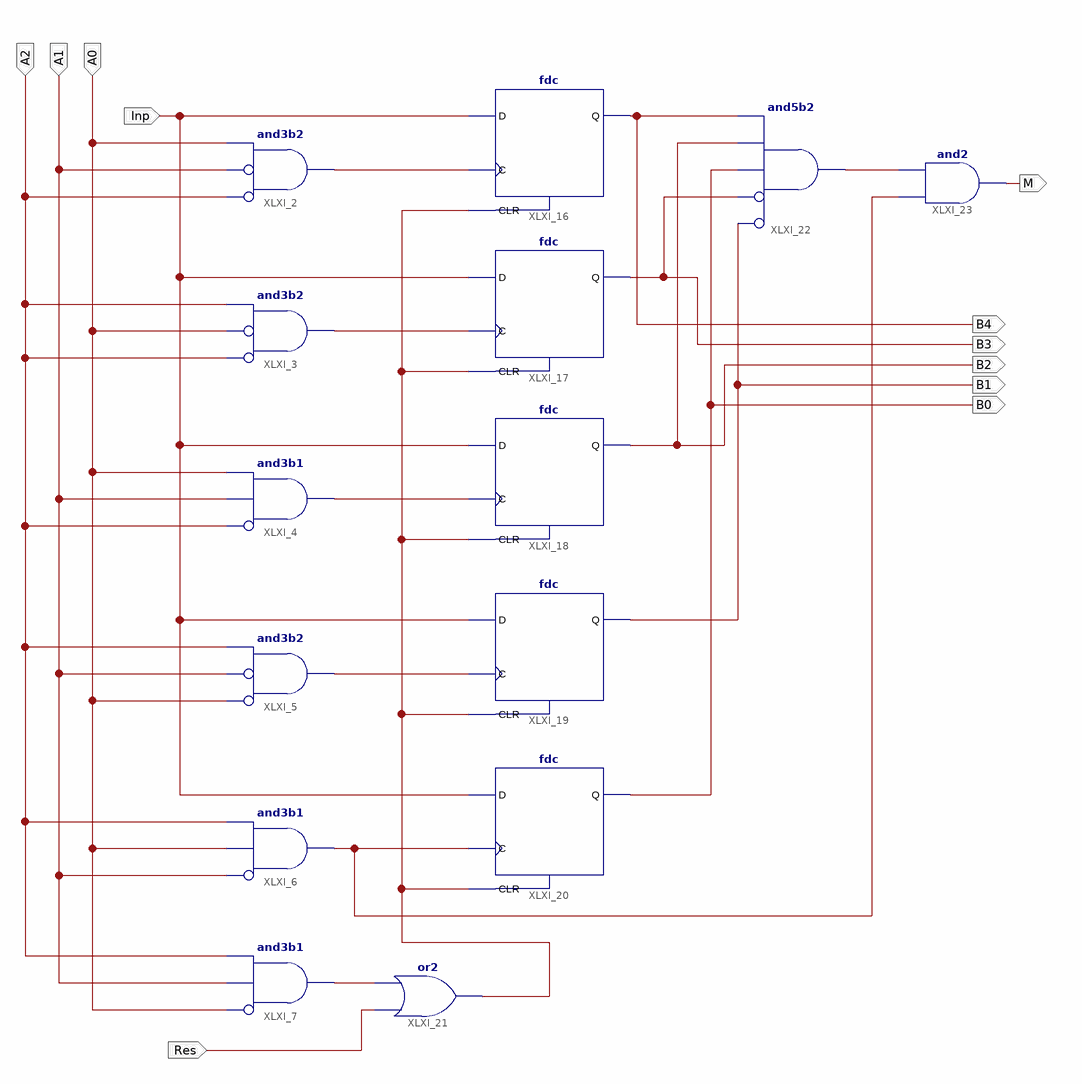
[diagram p0: schematic sheet 1]
// Xilinx ISE schematic registerMatch.sch (xc9500xl) as structural Verilog: 14 symbols, 11 ports
module registerMatch (
  input  A0,
  input  A1,
  input  A2,
  input  Inp,
  input  Res,
  output B4,
  output B0,
  output B1,
  output M,
  output B3,
  output B2
);

  wire XLXN_7, XLXN_8, XLXN_9, XLXN_10, XLXN_20, XLXN_25, XLXN_32, XLXN_33;

  and XLXI_2 (XLXN_7, ~A2, ~A1, A0);  // and3b2
  and XLXI_3 (XLXN_8, ~A2, ~A0, A2);  // and3b2
  and XLXI_4 (XLXN_9, ~A2, A1, A0);  // and3b1
  and XLXI_5 (XLXN_10, ~A0, ~A1, A2);  // and3b2
  and XLXI_7 (XLXN_20, ~A0, A1, A2);  // and3b1
  and XLXI_6 (XLXN_32, ~A1, A0, A2);  // and3b1
  fdc XLXI_16 (.C(XLXN_7), .CLR(XLXN_25), .D(Inp), .Q(B4));
  fdc XLXI_17 (.C(XLXN_8), .CLR(XLXN_25), .D(Inp), .Q(B3));
  fdc XLXI_18 (.C(XLXN_9), .CLR(XLXN_25), .D(Inp), .Q(B2));
  fdc XLXI_19 (.C(XLXN_10), .CLR(XLXN_25), .D(Inp), .Q(B1));
  fdc XLXI_20 (.C(XLXN_32), .CLR(XLXN_25), .D(Inp), .Q(B0));
  or XLXI_21 (XLXN_25, Res, XLXN_20);
  and XLXI_22 (XLXN_33, ~B1, ~B3, B0, B2, B4);  // and5b2
  and XLXI_23 (M, XLXN_32, XLXN_33);
endmodule
